# Altium schematic sheet Whitespace_Daughtercard_wifi.SchDoc: Wifi 2.4GHz Matching, PA Chain, TX/RX Switching
size A3; Author: Ryan E. Guerra; Revision: 1.1; SheetNumber: 8; SheetTotal: 10
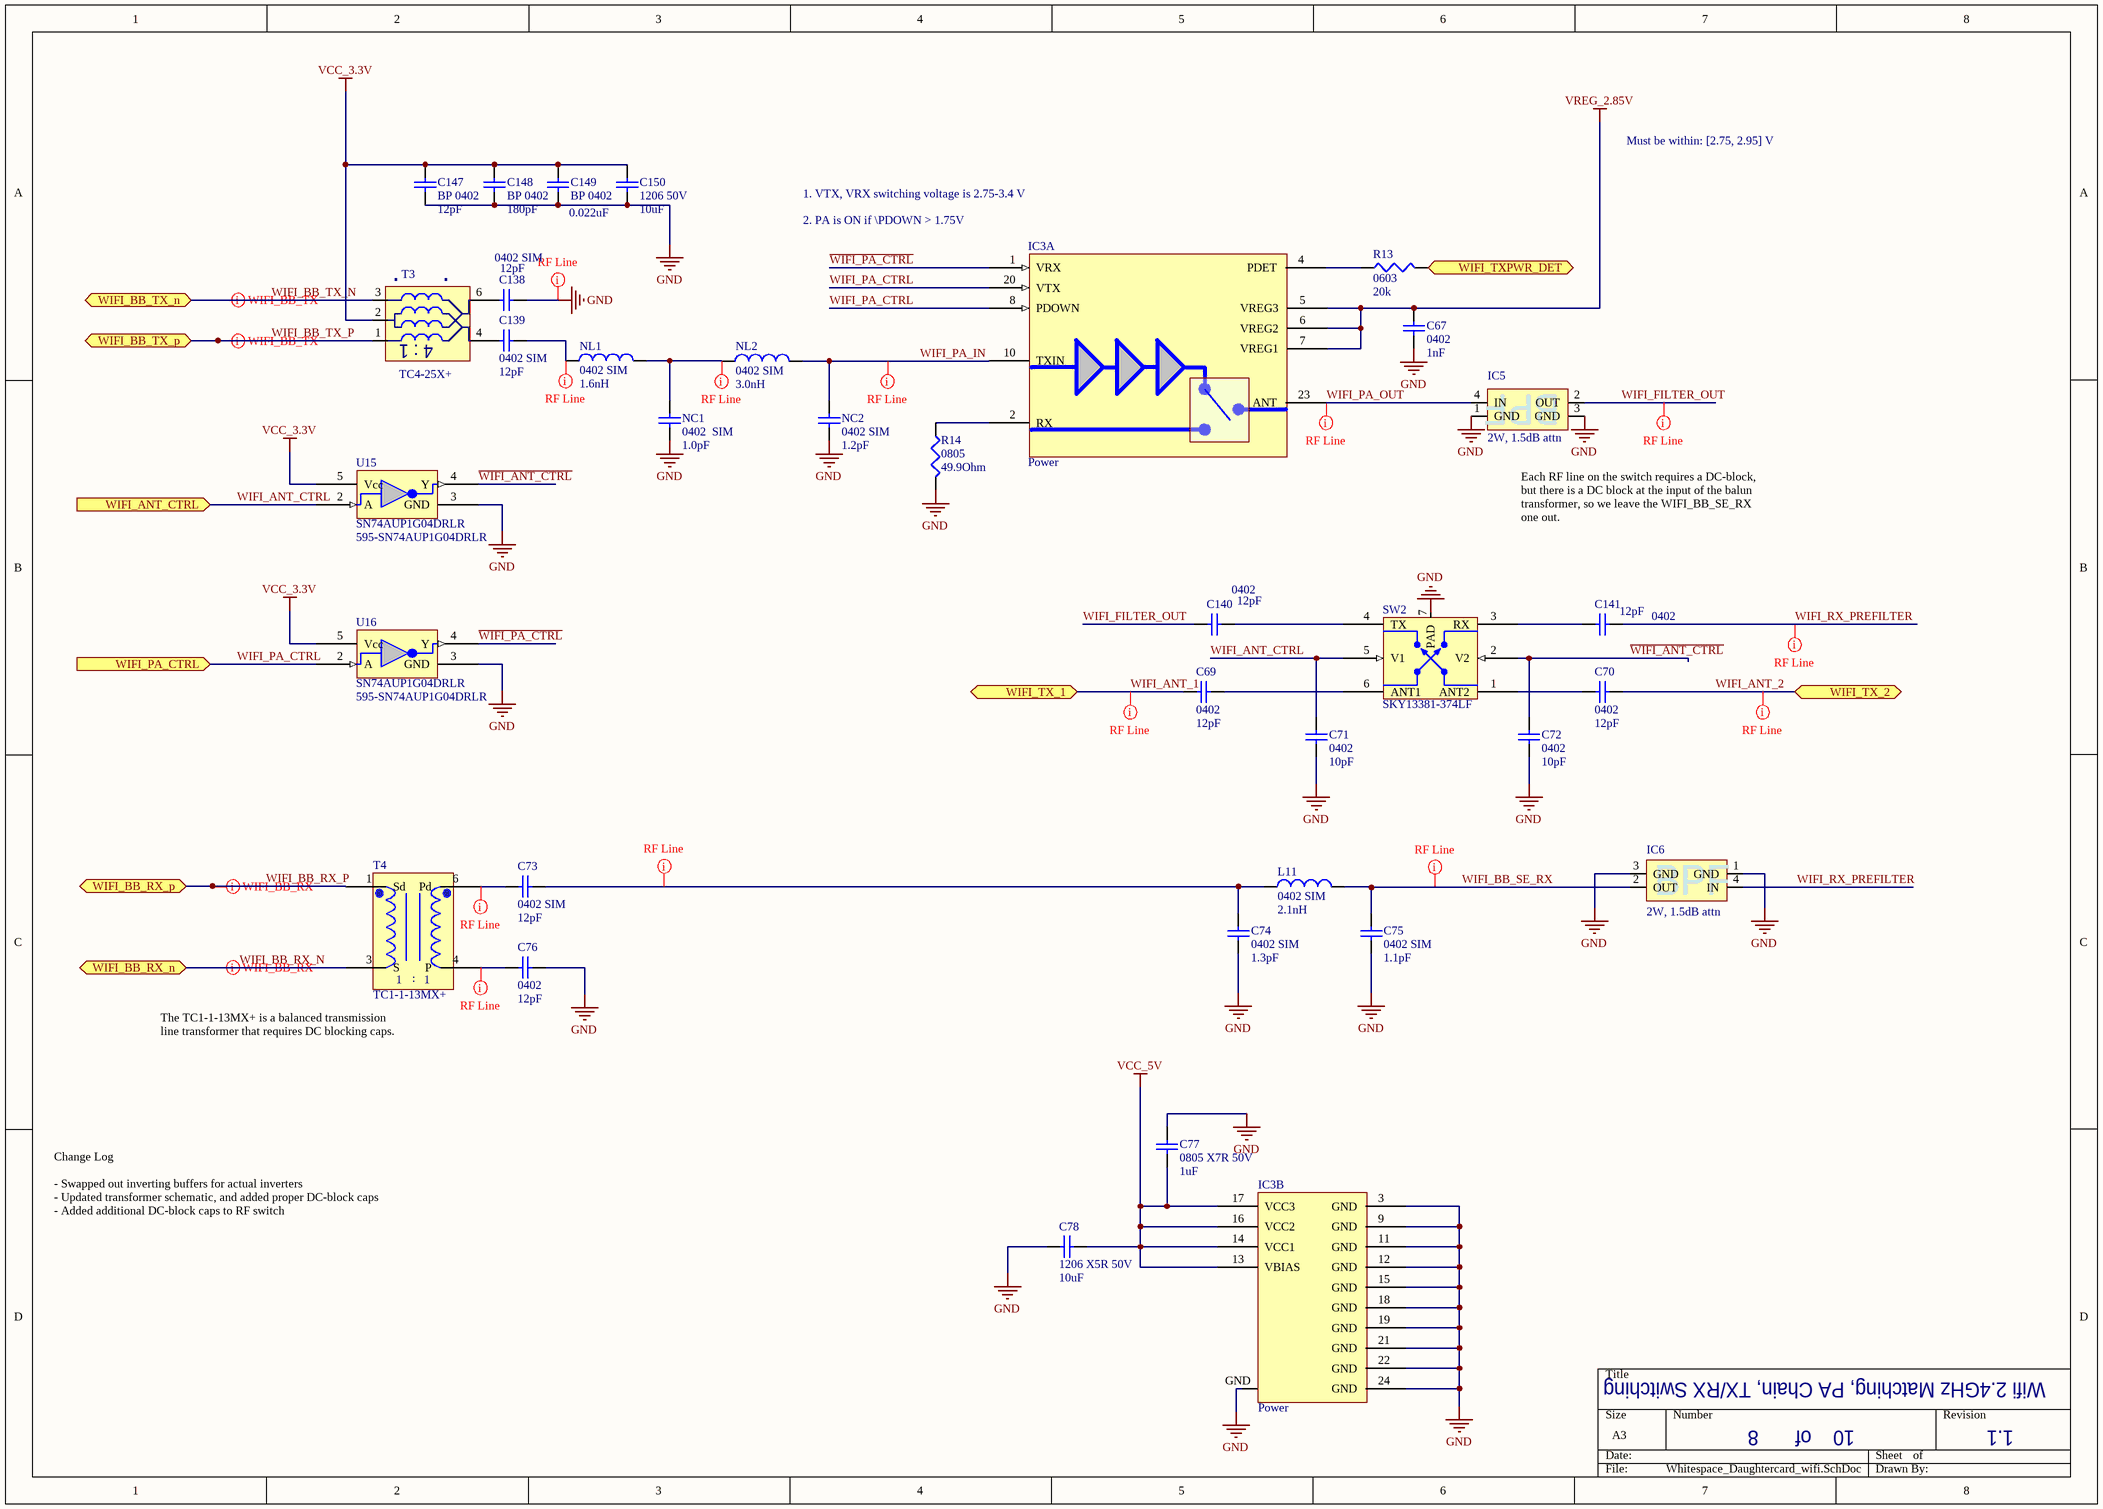
[diagram p0: Whitespace_Daughtercard_wifi.SchDoc]

## Parts
C67  0402  value 1nF  [0402_SMT_v3]
C69  0402  value 12pF  [0402_SMT_v3]
C70  0402  value 12pF  [0402_SMT_v3]
C71  0402  value 10pF  [0402_SMT_v3]
C72  0402  value 10pF  [0402_SMT_v3]
C73  0402 SIM  value 12pF  [0402_SMT_v3]
C74  0402 SIM  value 1.3pF  [0402_SMT_v3]
C75  0402 SIM  value 1.1pF  [0402_SMT_v3]
C76  0402  value 12pF  [0402_SMT_v3]
C77  0805 X7R 50V  value 1uF  [0805_SMT_v3]
C78  1206 X5R 50V  value 10uF  [1206_SMT_v3]
C138  0402 SIM  value 12pF  [0402_SMT_v3]
C139  0402 SIM  value 12pF  [0402_SMT_v3]
C140  0402  value 12pF  [0402_SMT_v3]
C141  0402  value 12pF  [0402_SMT_v3]
C147  BP 0402  value 12pF  [0402_SMT_v3]
C148  BP 0402  value 180pF  [0402_SMT_v3]
C149  BP 0402  value 0.022uF  [0402_SMT_V3]
C150  1206 50V  value 10uF  [1206_SMT_v3]
IC3  Power  [RFFM4202]  (parts A,B of 2)
IC5  2W, 1.5dB attn  [2450BP15E0100]
IC6  2W, 1.5dB attn  [2450BP15E0100]
L11  0402 SIM  value 2.1nH  [0402_SMT_v3]
NC1  0402  SIM  value 1.0pF  [0402_SMT_v3]
NC2  0402 SIM  value 1.2pF  [0402_SMT_v3]
NL1  0402 SIM  value 1.6nH  [0402_SMT_v3]
NL2  0402 SIM  value 3.0nH  [0402_SMT_v3]
R13  0603  value 20k  [0603_SMT_v3]
R14  0805  value 49.9Ohm  [0805_SMT_v3]
SW2  SKY13381-374LF  [SKY13381-374LF_v6]
T3  TC4-25X+  [AT224-1_V2]
T4  TC1-1-13MX+  [AT1521_MiniCircuits]
U15  SN74AUP1G04DRLR  Supplier Part Number 1: 595-SN74AUP1G04DRLR  [DRL_R-PDSO-N5_v2]
U16  SN74AUP1G04DRLR  Supplier Part Number 1: 595-SN74AUP1G04DRLR  [DRL_R-PDSO-N5_v2]

## Ports
WIFI_ANT_CTRL (in), WIFI_BB_RX_n, WIFI_BB_RX_p, WIFI_BB_TX_n, WIFI_BB_TX_p, WIFI_PA_CTRL (in), WIFI_TX_1, WIFI_TX_2, WIFI_TXPWR_DET (out)

## Nets
GND: C67.1 C71.1 C72.1 C74.1 C75.1 C76.2 C77.2 C78.1 C138.1 C147.1 C148.2 C149.1 C150.1 IC3.3(GND) IC3.9(GND) IC3.11(GND) IC3.12(GND) IC3.15(GND) IC3.18(GND) IC3.19(GND) IC3.21(GND) IC3.22(GND) IC3.24(GND) IC3.GND(GND_PAD) IC5.1(GND) IC5.3(GND) IC6.1(GND) IC6.3(GND) NC1.1 NC2.1 R14.2 SW2.7(PAD) U15.3(GND) U16.3(GND)
VCC_3.3V: C147.2 C148.1 C149.2 C150.2 T3.2(S_CT) U15.5(Vcc) U16.5(Vcc)
VCC_5V: C77.1 C78.2 IC3.13(VBIAS) IC3.14(VCC1) IC3.16(VCC2) IC3.17(VCC3)
VREG_2.85V: C67.2 IC3.5(VREG3) IC3.6(VREG2) IC3.7(VREG1)
~{WIFI_ANT_CTRL}: C72.2 SW2.2(V2) U15.4(Y)
~{WIFI_PA_CTRL}: IC3.1(VRX) U16.4(Y)
WIFI_ANT_1: C69.2 ; port WIFI_TX_1
WIFI_ANT_2: C70.2 ; port WIFI_TX_2
WIFI_ANT_CTRL: C71.2 SW2.5(V1) U15.2(A) ; port WIFI_ANT_CTRL
WIFI_BB_RX_N: T4.3(S) ; port WIFI_BB_RX_n
WIFI_BB_RX_P: T4.1(Sd) ; port WIFI_BB_RX_p
WIFI_BB_SE_RX: C75.2 IC6.2(OUT) L11.2
WIFI_BB_TX_N: T3.3(S_DOT) ; port WIFI_BB_TX_n
WIFI_BB_TX_P: T3.1(S) ; port WIFI_BB_TX_p
WIFI_FILTER_OUT: C140.1 IC5.2(OUT)
WIFI_PA_CTRL: IC3.8(PDOWN) IC3.20(VTX) U16.2(A) ; port WIFI_PA_CTRL
WIFI_PA_IN: IC3.10(TXIN) NC2.2 NL2.2
WIFI_PA_OUT: IC3.23(ANT) IC5.4(IN)
WIFI_RX_PREFILTER: C141.2 IC6.4(IN)
WIFI_TXPWR_DET: R13.2 ; port WIFI_TXPWR_DET
NetC69_1: C69.1 SW2.6(ANT1)
NetC70_1: C70.1 SW2.1(ANT2)
NetC73_1: C73.1 T4.6(Pd)
NetC73_2: C73.2 C74.2 L11.1
NetC76_1: C76.1 T4.4(P)
NetC138_2: C138.2 T3.6(P_DOT)
NetC139_1: C139.1 NL1.1
NetC139_2: C139.2 T3.4(P)
NetC140_2: C140.2 SW2.4(TX)
NetC141_1: C141.1 SW2.3(RX)
NetIC3_2: IC3.2(RX) R14.1
NetIC3_4: IC3.4(PDET) R13.1
NetNC1_2: NC1.2 NL1.2 NL2.1

## Layout directives
differential pair: WIFI_BB_RX_N, WIFI_BB_RX_P, WIFI_BB_TX_N, WIFI_BB_TX_P
rule Impedance Constraint [Min = 49.00    Max = 51.00    ]; net class RF: GND, NetC73_1, NetC73_2, NetC76_1, NetC139_1, NetNC1_2, WIFI_ANT_1, WIFI_ANT_2, WIFI_BB_SE_RX, WIFI_FILTER_OUT, WIFI_PA_IN, WIFI_PA_OUT, WIFI_RX_PREFILTER

## Notes on the sheet
- Must be within: [2.75, 2.95] V
- 2. PA is ON if \PDOWN > 1.75V
- 1. VTX, VRX switching voltage is 2.75-3.4 V
- (near IC5) Each RF line on the switch requires a DC-block, but there is a DC block at the input of the balun transformer, so we leave the WIFI_BB_SE_RX one out.
- (near T4) The TC1-1-13MX+ is a balanced transmission line transformer that requires DC blocking caps.
- Change Log
  - Swapped out inverting buffers for actual inverters
  - Updated transformer schematic, and added proper DC-block caps
  - Added additional DC-block caps to RF switch
- of
- (in symbol 2450BP15E0100) BPF
- (in symbol TC1-1-13MX+) :
- (in symbol TC4-25X+) .; 4 : 1

## Library data of the parts
C67 C71-C78 NC1 NC2 = Cap Semi: Capacitor (Semiconductor SIM Model); Published: 8-Jun-2000; LatestRevisionDate: 29-May-2009; LatestRevisionNote: IPC-7351 Footprint Added.; PackageReference: C1206; Publisher: Altium Limited; PackageDescription: Chip Capacitor; Supplier 1: Mouser
  C67: Supplier Part Number 1: 81-GRM1555C1H102GA1D
  C71 C72: Supplier Part Number 1: 81-GRM1555C1H100JA1D
  C73 C76: Supplier Part Number 1: 81-GRM1555C1H120JA1D
  C74: Supplier Part Number 1: 81-GRM1555C1H1R3BA1D
  C75: Supplier Part Number 1: 81-GRM1555C1H1R1WA1D
  C77: Supplier Part Number 1: 963-UMK212B7105KG-T
  C78: Supplier Part Number 1: 81-GRM31CR61H106KA2L
  NC1: Supplier Part Number 1: 81-GRM1555C1H1R0WA1D
  NC2: Supplier Part Number 1: 81-GRM1555C1H1R2WA1D
C69 C70 C138-C141 C147-C150 = Cap: Capacitor; Published: 8-Jun-2000; LatestRevisionDate: 17-Jul-2002; LatestRevisionNote: Re-released for DXP Platform.; PackageReference: RAD-0.3; Publisher: Altium Limited; PackageDescription: Radial Cap, Thru-Hole; 2 Leads; 0.3 in Pin Spacing; Supplier 1: Mouser
  C69 C70 C138-C141 C147: Supplier Part Number 1: 81-GRM1555C1H120GA1D
  C148: Supplier Part Number 1: 81-GRM1555C1H181GA1D
  C149: Supplier Part Number 1: 81-GRM155R71H223KA2J
  C150: Supplier Part Number 1: 81-GRM31CR61H106KA2L
IC3 = RFFM4202: 5V, 2.4 to 2.5 GHz FEM w/ PA + PwrDet + SW; Manufacturer: RFMD; Supplier 1: RFMD; Supplier Part Number 1: RFFM4202
IC5 IC6 = 2450BP15E0100: Johanson 2450 MHz Band Pass Ceramic Filter 2400-2500MHz; Supplier 1: Digi-Key; Supplier Part Number 1: 712-1081-6-ND
L11 NL1 NL2 = Inductor: Code_IEC: 1005; Published: 8-Jun-2000; LatestRevisionDate: 29-May-2009; LatestRevisionNote: IPC-7351 Footprint Added.; PackageReference: 0402-A; Publisher: Altium Limited; PackageDescription: Chip Inductor; Code_JEITA: 0402; Supplier 1: Mouser
  L11: Supplier Part Number 1: 81-LQP15MN2N0W02D
  NL1: Supplier Part Number 1: 81-LQP15MN1N6W02D
  NL2: Supplier Part Number 1: 81-LQP15MN3N0W02D
R13 R14 = Res3: Resistor; Published: 8-Jun-2000; LatestRevisionDate: 29-May-2009; LatestRevisionNote: IPC-7351 Footprint Added.; PackageReference: J1-0603; Publisher: Altium Limited; PackageDescription: Chip Resistor; Supplier 1: Mouser
  R13: Supplier Part Number 1: 667-ERA-3AED203V
  R14: Supplier Part Number 1: 667-ERJ-6ENF49R9V
SW2 = SKY13381-374LF: GaAs pHEMT DPDT switch 0.1-6.0 GHz; Supplier 1: Mouser; Supplier Part Number 1: 873-SKY13381-374LF
T3 = TC4-25X+: Mini-Circuits Type A Transformer, 4:1 Ohm, CT, 500-2500MHz
T4 = TC1-1-13MX+: Mini-Circuits Type G 4.5-3000MHz 1:1 Transformer
U15 U16 = SN74AUP1G04DRLR: Inverters Lo Pwr Sngl Invter Gate; Supplier 1: Mouser